# EAGLE schematic template_L_01 (EAGLE 7.2.0)
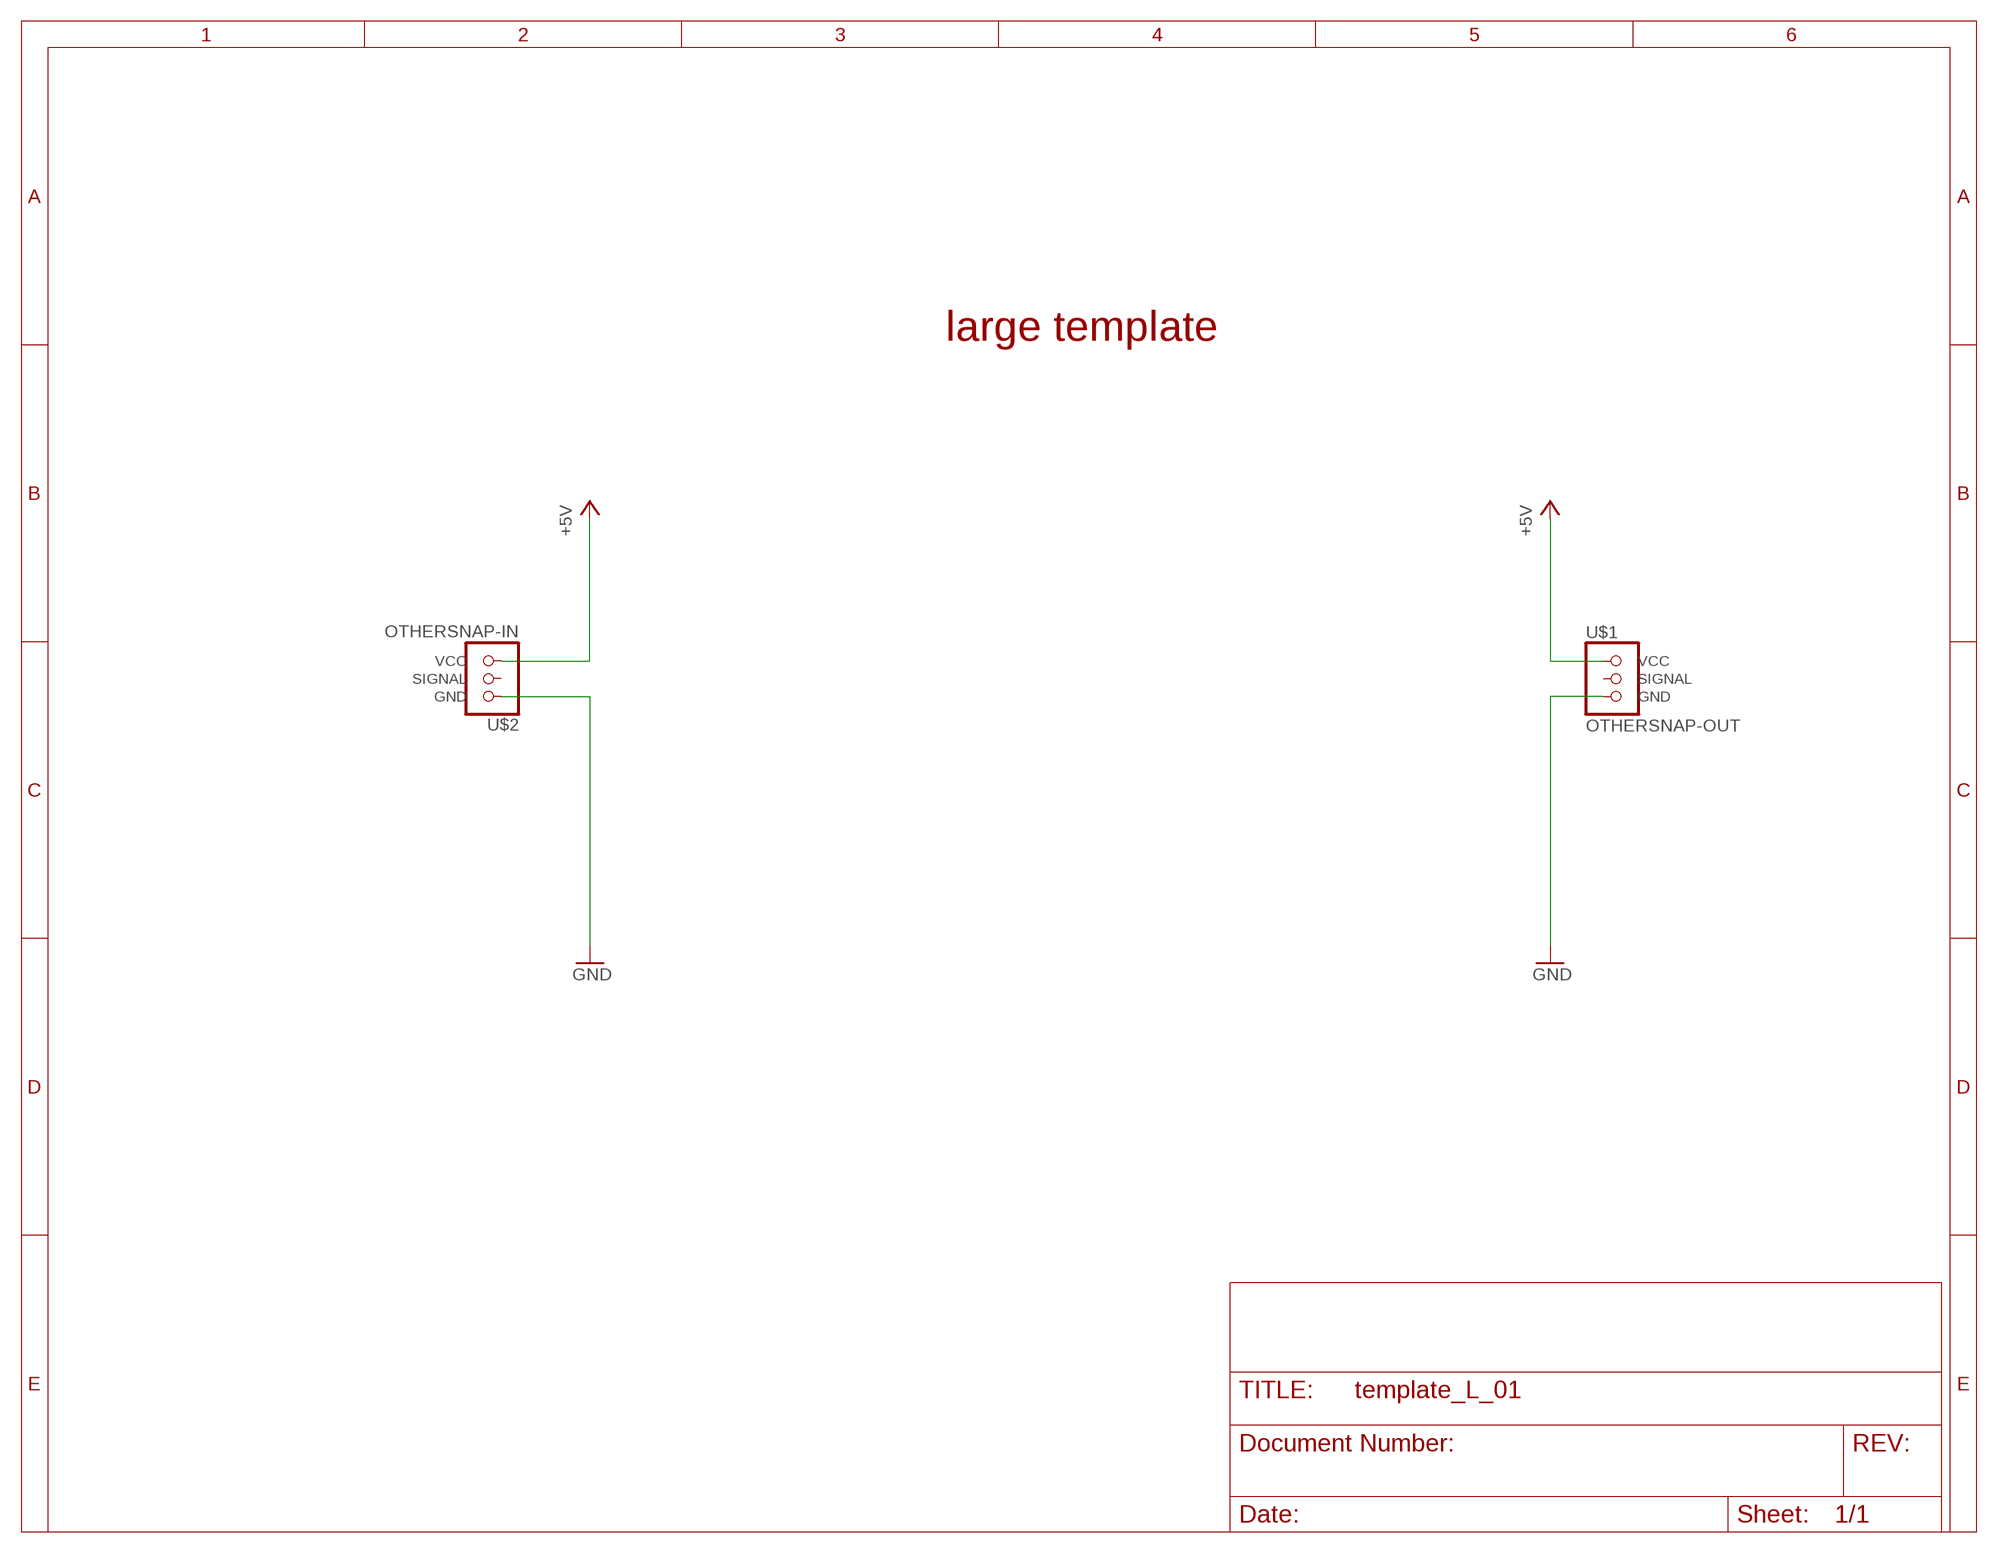
[diagram p0: schematic, sheet 1]

## Parts
U$1  OTHERSNAP-OUT  [OTHERSNAP-OUT]
U$2  OTHERSNAP-IN  [OTHERSNAP-IN]

## Nets
+5V: U$1.VCC U$2.VCC
GND: U$1.GND U$2.GND
Unconnected: U$1.SIGNAL U$2.SIGNAL

## Notes on the sheet
- large template

## Library data of the parts
U$1 = mentor2:OTHERSNAP-OUT
U$2 = mentor2:OTHERSNAP-IN